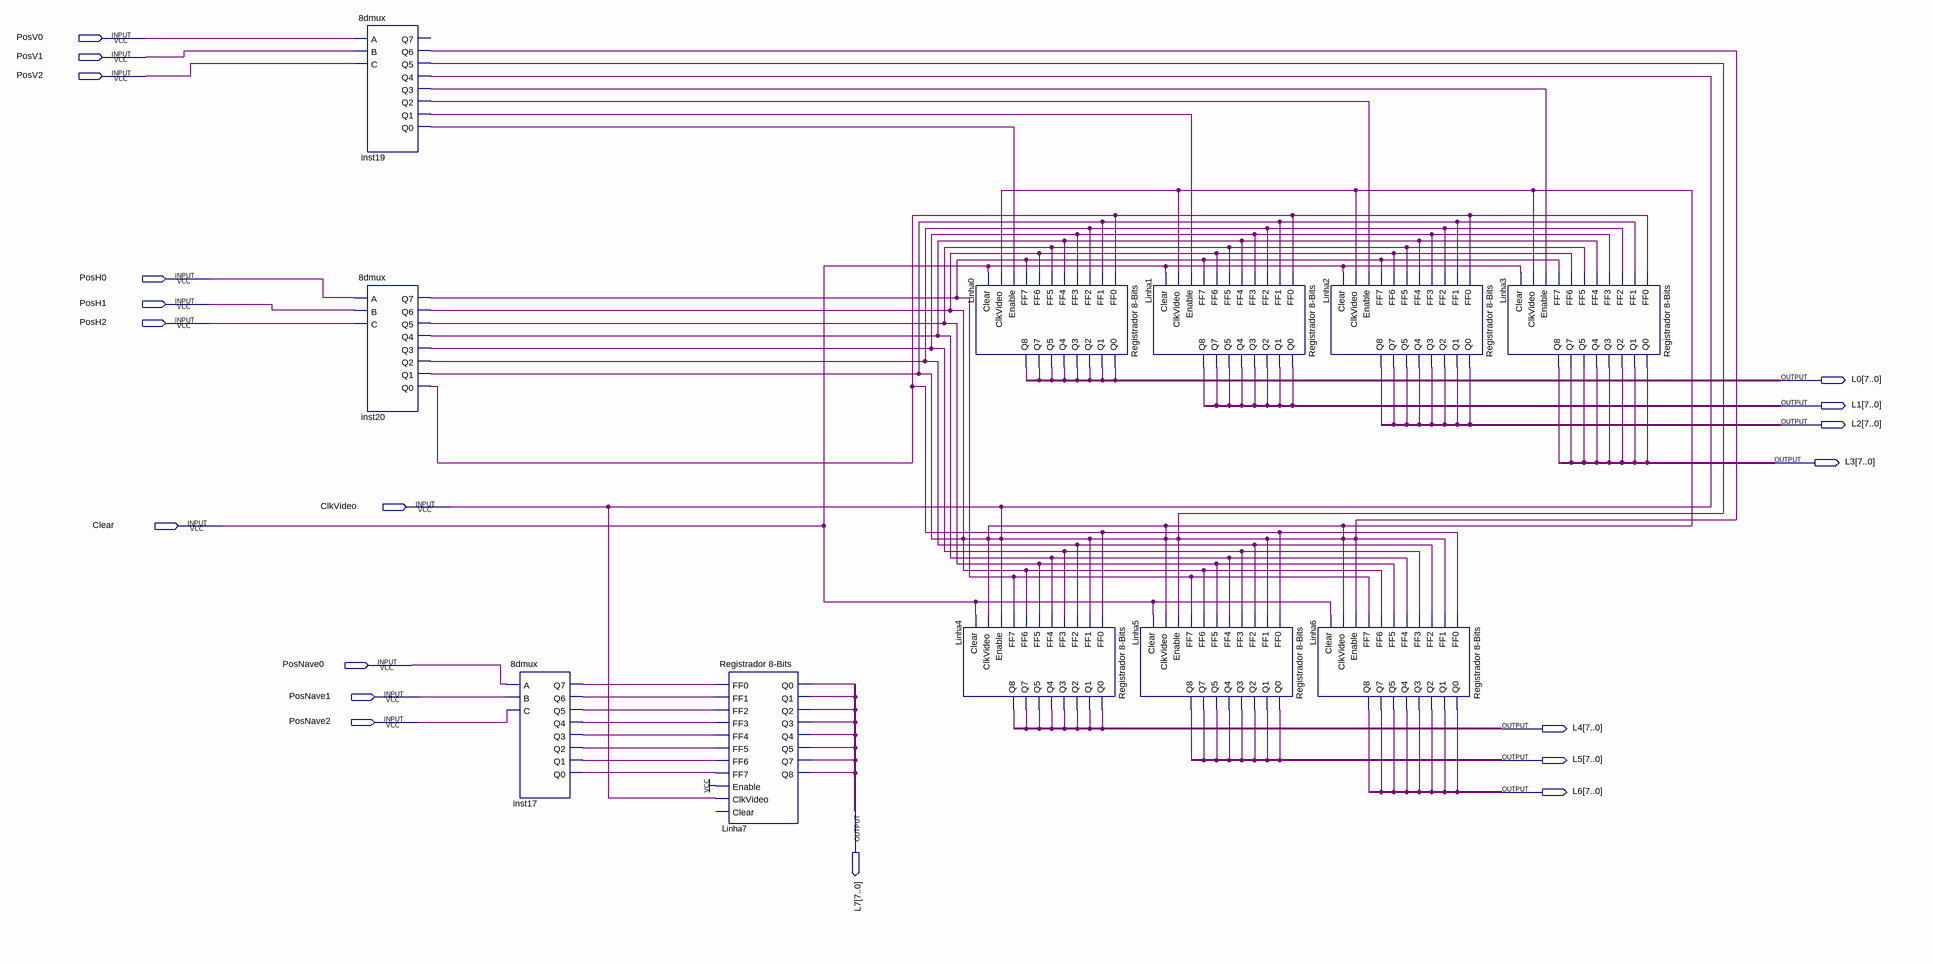
[diagram p0: schematic sheet]
// Quartus schematic Registradores do Display.bdf as structural Verilog: 11 symbols, 19 pins
module \Registradores_do_Display  (
  input  PosV0,
  input  PosV1,
  input  PosV2,
  input  PosH0,
  input  PosH1,
  input  PosH2,
  input  ClkVideo,
  input  Clear,
  input  PosNave0,
  input  PosNave1,
  input  PosNave2,
  output [7:0] L0,
  output [7:0] L1,
  output [7:0] L2,
  output [7:0] L3,
  output [7:0] L4,
  output [7:0] L5,
  output [7:0] L6,
  output [7:0] L7
);

  wire inst17_q0, inst17_q1, inst17_q2, inst17_q3, inst17_q4, inst17_q5, inst17_q6, inst17_q7, inst19_q0,
       inst19_q1, inst19_q2, inst19_q3, inst20_q0, inst20_q2, inst20_q3, inst20_q4, inst20_q5, inst20_q7,
       Linha0_q0, Linha0_q1, Linha0_q2, Linha0_q3, Linha0_q4, Linha0_q5, Linha0_q7, Linha0_q8, Linha1_q0,
       Linha1_q1, Linha1_q2, Linha1_q3, Linha1_q4, Linha1_q5, Linha1_q7, Linha1_q8, Linha2_q0, Linha2_q1,
       Linha2_q2, Linha2_q3, Linha2_q4, Linha2_q5, Linha2_q7, Linha2_q8, Linha3_q0, Linha3_q1, Linha3_q2,
       Linha3_q3, Linha3_q4, Linha3_q5, Linha3_q7, Linha3_q8, Linha4_q0, Linha4_q1, Linha4_q2, Linha4_q3,
       Linha4_q4, Linha4_q5, Linha4_q7, Linha4_q8, Linha5_q0, Linha5_q1, Linha5_q2, Linha5_q3, Linha5_q4,
       Linha5_q5, Linha5_q7, Linha5_q8, Linha6_q0, Linha6_q1, Linha6_q2, Linha6_q3, Linha6_q4, Linha6_q5,
       Linha6_q7, Linha6_q8, Linha7_q0, Linha7_q1, Linha7_q2, Linha7_q3, Linha7_q4, Linha7_q5, Linha7_q7,
       Linha7_q8;

  \8dmux  inst19 (
    .A(PosV0), .B(PosV1), .C(PosV2), .Q6(ClkVideo), .Q5(ClkVideo), .Q4(ClkVideo), .Q3(inst19_q3),
    .Q2(inst19_q2), .Q1(inst19_q1), .Q0(inst19_q0));  // open: Q7
  \8dmux  inst20 (
    .A(PosH0), .B(PosH1), .C(PosH2), .Q7(inst20_q7), .Q6(ClkVideo), .Q5(inst20_q5), .Q4(inst20_q4),
    .Q3(inst20_q3), .Q2(inst20_q2), .Q1(ClkVideo), .Q0(inst20_q0));
  \8dmux  inst17 (
    .A(PosNave0), .B(PosNave1), .C(PosNave2), .Q7(inst17_q7), .Q6(inst17_q6), .Q5(inst17_q5), .Q4(inst17_q4),
    .Q3(inst17_q3), .Q2(inst17_q2), .Q1(inst17_q1), .Q0(inst17_q0));
  \Registrador_8-Bits  Linha7 (
    .FF0(inst17_q7), .FF1(inst17_q6), .FF2(inst17_q5), .FF3(inst17_q4), .FF4(inst17_q3), .FF5(inst17_q2),
    .FF6(inst17_q1), .FF7(inst17_q0), .Enable(1'b1), .ClkVideo(ClkVideo), .Q0(Linha7_q0), .Q1(Linha7_q1),
    .Q2(Linha7_q2), .Q3(Linha7_q3), .Q4(Linha7_q4), .Q5(Linha7_q5), .Q7(Linha7_q7), .Q8(Linha7_q8));  // open: Clear
  \Registrador_8-Bits  Linha0 (
    .FF0(inst20_q0), .FF1(ClkVideo), .FF2(inst20_q2), .FF3(inst20_q3), .FF4(inst20_q4), .FF5(inst20_q5),
    .FF6(ClkVideo), .FF7(inst20_q7), .Enable(inst19_q0), .ClkVideo(ClkVideo), .Clear(Clear), .Q0(Linha0_q0),
    .Q1(Linha0_q1), .Q2(Linha0_q2), .Q3(Linha0_q3), .Q4(Linha0_q4), .Q5(Linha0_q5), .Q7(Linha0_q7),
    .Q8(Linha0_q8));
  \Registrador_8-Bits  Linha4 (
    .FF0(inst20_q0), .FF1(ClkVideo), .FF2(inst20_q2), .FF3(inst20_q3), .FF4(inst20_q4), .FF5(inst20_q5),
    .FF6(ClkVideo), .FF7(inst20_q7), .Enable(ClkVideo), .ClkVideo(ClkVideo), .Clear(Clear), .Q0(Linha4_q0),
    .Q1(Linha4_q1), .Q2(Linha4_q2), .Q3(Linha4_q3), .Q4(Linha4_q4), .Q5(Linha4_q5), .Q7(Linha4_q7),
    .Q8(Linha4_q8));
  \Registrador_8-Bits  Linha5 (
    .FF0(inst20_q0), .FF1(ClkVideo), .FF2(inst20_q2), .FF3(inst20_q3), .FF4(inst20_q4), .FF5(inst20_q5),
    .FF6(ClkVideo), .FF7(inst20_q7), .Enable(ClkVideo), .ClkVideo(ClkVideo), .Clear(Clear), .Q0(Linha5_q0),
    .Q1(Linha5_q1), .Q2(Linha5_q2), .Q3(Linha5_q3), .Q4(Linha5_q4), .Q5(Linha5_q5), .Q7(Linha5_q7),
    .Q8(Linha5_q8));
  \Registrador_8-Bits  Linha1 (
    .FF0(inst20_q0), .FF1(ClkVideo), .FF2(inst20_q2), .FF3(inst20_q3), .FF4(inst20_q4), .FF5(inst20_q5),
    .FF6(ClkVideo), .FF7(inst20_q7), .Enable(inst19_q1), .ClkVideo(ClkVideo), .Clear(Clear), .Q0(Linha1_q0),
    .Q1(Linha1_q1), .Q2(Linha1_q2), .Q3(Linha1_q3), .Q4(Linha1_q4), .Q5(Linha1_q5), .Q7(Linha1_q7),
    .Q8(Linha1_q8));
  \Registrador_8-Bits  Linha2 (
    .FF0(inst20_q0), .FF1(ClkVideo), .FF2(inst20_q2), .FF3(inst20_q3), .FF4(inst20_q4), .FF5(inst20_q5),
    .FF6(ClkVideo), .FF7(inst20_q7), .Enable(inst19_q2), .ClkVideo(ClkVideo), .Clear(Clear), .Q0(Linha2_q0),
    .Q1(Linha2_q1), .Q2(Linha2_q2), .Q3(Linha2_q3), .Q4(Linha2_q4), .Q5(Linha2_q5), .Q7(Linha2_q7),
    .Q8(Linha2_q8));
  \Registrador_8-Bits  Linha6 (
    .FF0(inst20_q0), .FF1(ClkVideo), .FF2(inst20_q2), .FF3(inst20_q3), .FF4(inst20_q4), .FF5(inst20_q5),
    .FF6(ClkVideo), .FF7(inst20_q7), .Enable(ClkVideo), .ClkVideo(ClkVideo), .Clear(Clear), .Q0(Linha6_q0),
    .Q1(Linha6_q1), .Q2(Linha6_q2), .Q3(Linha6_q3), .Q4(Linha6_q4), .Q5(Linha6_q5), .Q7(Linha6_q7),
    .Q8(Linha6_q8));
  \Registrador_8-Bits  Linha3 (
    .FF0(inst20_q0), .FF1(ClkVideo), .FF2(inst20_q2), .FF3(inst20_q3), .FF4(inst20_q4), .FF5(inst20_q5),
    .FF6(ClkVideo), .FF7(inst20_q7), .Enable(inst19_q3), .ClkVideo(ClkVideo), .Clear(Clear), .Q0(Linha3_q0),
    .Q1(Linha3_q1), .Q2(Linha3_q2), .Q3(Linha3_q3), .Q4(Linha3_q4), .Q5(Linha3_q5), .Q7(Linha3_q7),
    .Q8(Linha3_q8));
endmodule
